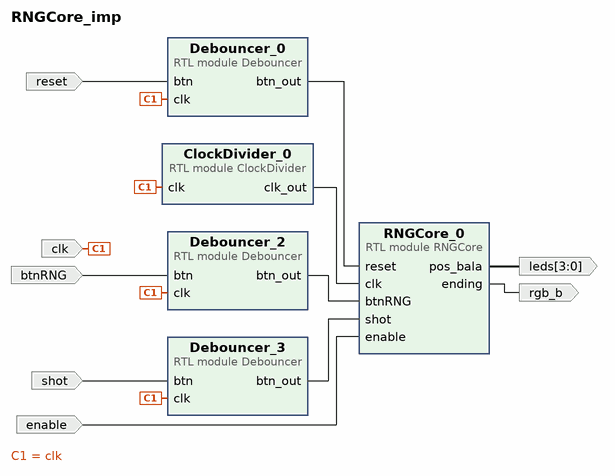
[diagram p0: block diagram of the top level]
# Vivado block design RNGCore_imp, xc7z010clg400-1, Vivado 2020.1
create_bd_design RNGCore_imp

create_bd_port -dir I -type clk clk
set_property -dict {CONFIG.FREQ_HZ 125000000} [get_bd_ports clk]
create_bd_port -dir I reset
create_bd_port -dir I enable
create_bd_port -dir I btnRNG
create_bd_port -dir I shot
create_bd_port -dir O -from 3 -to 0 leds
create_bd_port -dir O rgb_b

create_bd_cell -type module -reference RNGCore RNGCore_0
create_bd_cell -type module -reference ClockDivider ClockDivider_0
set_property -dict {CONFIG.FREQ_DES 100} [get_bd_cells ClockDivider_0]
create_bd_cell -type module -reference Debouncer Debouncer_0
create_bd_cell -type module -reference Debouncer Debouncer_2
create_bd_cell -type module -reference Debouncer Debouncer_3

# ---- connections ----

connect_bd_net [get_bd_pins ClockDivider_0/clk_out] [get_bd_pins RNGCore_0/clk]
connect_bd_net [get_bd_pins Debouncer_2/btn_out] [get_bd_pins RNGCore_0/btnRNG]
connect_bd_net [get_bd_pins Debouncer_0/btn_out] [get_bd_pins RNGCore_0/reset]
connect_bd_net [get_bd_pins Debouncer_3/btn_out] [get_bd_pins RNGCore_0/shot]
connect_bd_net [get_bd_ports clk] \
  [get_bd_pins ClockDivider_0/clk] [get_bd_pins Debouncer_0/clk] [get_bd_pins Debouncer_2/clk] [get_bd_pins Debouncer_3/clk]
connect_bd_net [get_bd_ports reset] [get_bd_pins Debouncer_0/btn]
connect_bd_net [get_bd_ports enable] [get_bd_pins RNGCore_0/enable]
connect_bd_net [get_bd_ports btnRNG] [get_bd_pins Debouncer_2/btn]
connect_bd_net [get_bd_ports shot] [get_bd_pins Debouncer_3/btn]
connect_bd_net [get_bd_pins RNGCore_0/pos_bala] [get_bd_ports leds]
connect_bd_net [get_bd_pins RNGCore_0/ending] [get_bd_ports rgb_b]

validate_bd_design
save_bd_design
